# Altium schematic sheet power_supply.SchDoc: Power Supply
size A4; Date: 27.05.2014; Author: Stefan Lüthi; DrawnBy: Stefan Lüthi; Organization: BFH; Address1: Bern University of Applied Sciences; Address2: Engineering and Information Technology; Address3: Jlcoweg 1; Address4: CH-3400 Burgdorf; DocumentNumber: 1; Revision: 1.0; SheetNumber: 2; SheetTotal: 8; CurrentDate: 27.05.2014
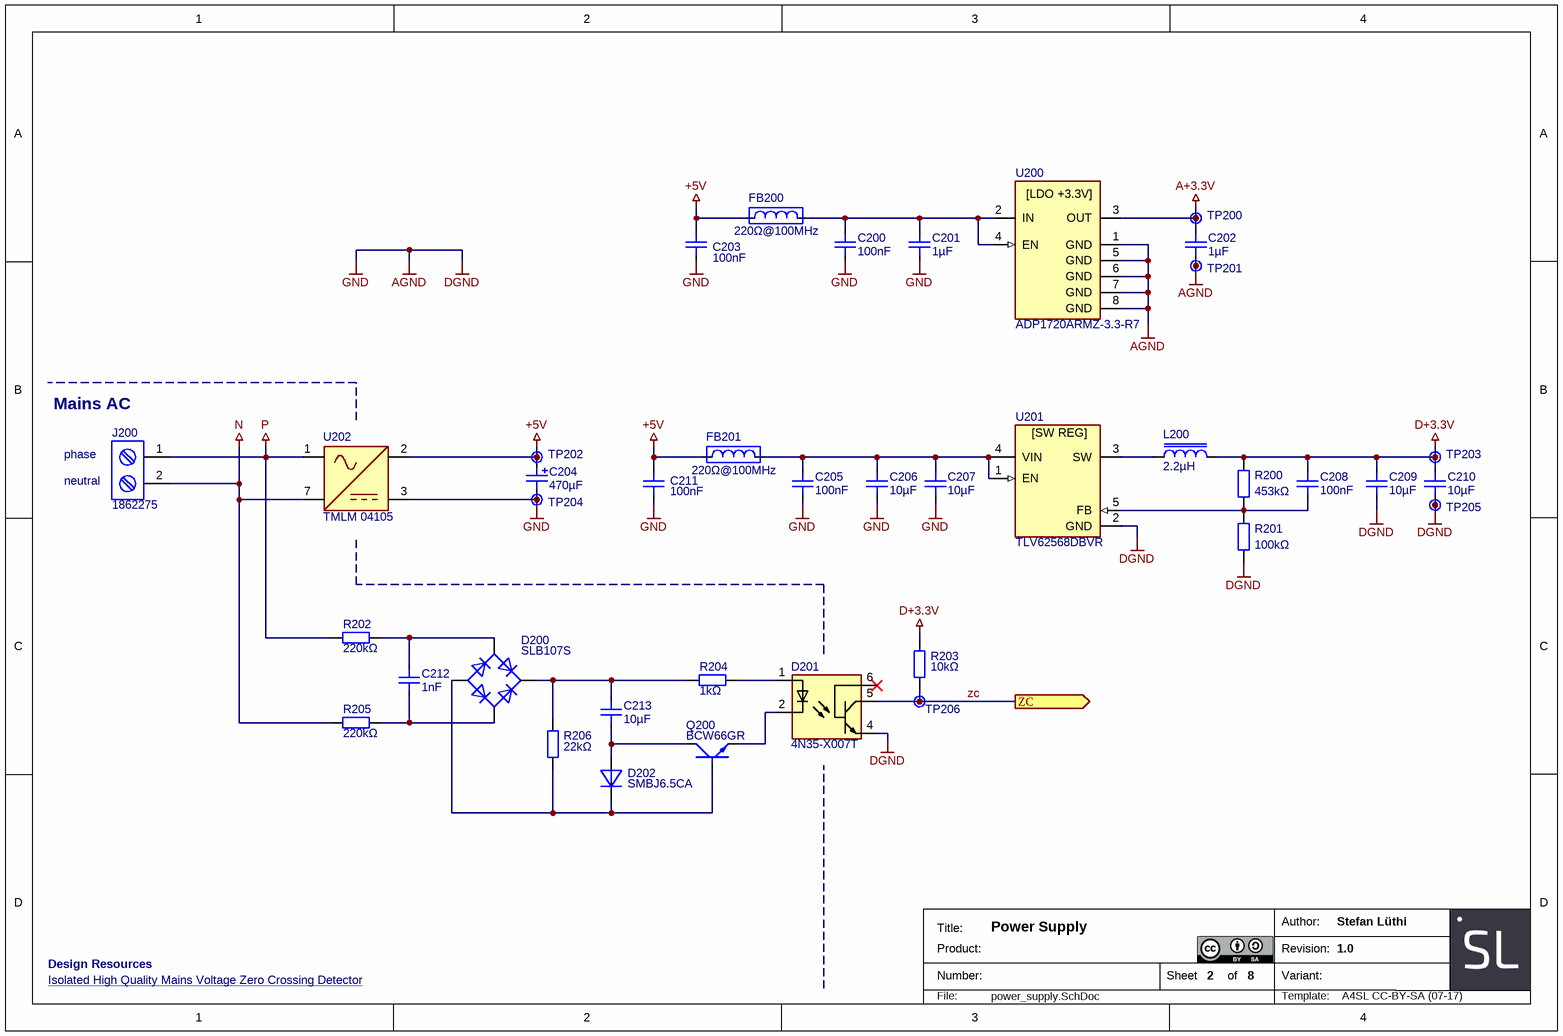
[diagram p0: power_supply.SchDoc]

## Parts
C200  100nF  [SMD0603CAP]
C201  1µF  [SMD0603CAP]
C202  1µF  [SMD0603CAP]
C203  100nF  [SMD0603CAP]
C204  470µF  [CAP-12.5-20-5]
C205  100nF  [SMD0603CAP]
C206  10µF  [SMD1206CAP]
C207  10µF  [SMD1206CAP]
C208  100nF  [SMD0603CAP]
C209  10µF  [SMD1206CAP]
C210  10µF  [SMD1206CAP]
C211  100nF  [SMD0603CAP]
C212  1nF  [SMD0603CAP]
C213  10µF  [SMD1206CAP]
D200  SLB107S  [SLDBS-4]
D201  4N35-X007T  [SMT6-LB]
D202  SMBJ6.5CA  [DO-214AA]
FB200  220Ω@100MHz  [SMD0603RES]
FB201  220Ω@100MHz  [SMD0603RES]
J200  1862275  [1862275]
L200  2.2µH  [WE4040]
Q200  BCW66GR  [SOT-23]
R200  453kΩ  [SMD0603RES]
R201  100kΩ  [SMD0603RES]
R202  220kΩ  [SMD2010RES]
R203  10kΩ  [SMD0603RES]
R204  1kΩ  [SMD0603RES]
R205  220kΩ  [SMD2010RES]
R206  22kΩ  [SMD0603RES]
TP200  Testpoint  [TP]  (value not drawn)  (no BOM)
TP201  Testpoint  [TP]  (value not drawn)  (no BOM)
TP202  Testpoint  [TP]  (value not drawn)  (no BOM)
TP203  Testpoint  [TP]  (value not drawn)  (no BOM)
TP204  Testpoint  [TP]  (value not drawn)  (no BOM)
TP205  Testpoint  [TP]  (value not drawn)  (no BOM)
TP206  Testpoint  [TP]  (value not drawn)  (no BOM)
U200  ADP1720ARMZ-3.3-R7  [MSOP8]
U201  TLV62568DBVR  [SOT-23-5]
U202  TMLM 04105  [TMLM04]

## Ports
ZC (out)

## Nets
+5V: C203.1 C204.P C211.1 FB200.1 FB201.1 TP202.1 U202.2(V+)
A+3.3V: C202.1 TP200.1 U200.3(OUT)
AGND: C200.2 C201.2 C202.2 C203.2 C204.M C205.2 C206.2 C207.2 C209.2 C210.2 C211.2 D201.4 R201.1 TP201.1 TP204.1 TP205.1 U200.1(GND) U200.5(GND) U200.6(GND) U200.7(GND) U200.8(GND) U201.2(GND) U202.3(GND)  [also labelled DGND, GND]
D+3.3V: C208.1 C209.1 C210.1 L200.2 R200.2 R203.2 TP203.1
N: J200.2 R205.2 U202.7(AC)
P: J200.1 R202.2 U202.1(AC)
zc: D201.5 R203.1 TP206.1 ; port ZC
NetC200_1: C200.1 C201.1 FB200.2 U200.2(IN) U200.4(EN)
NetC205_1: C205.1 C206.1 C207.1 FB201.2 U201.1(EN) U201.4(VIN)
NetC208_2: C208.2 R200.1 R201.2 U201.5(FB)
NetC212_1: C212.1 D200.3 R205.1
NetC212_2: C212.2 D200.2 R202.1
NetC213_1: C213.1 D200.1 R204.2 R206.2
NetC213_2: C213.2 D202.A Q200.3(C)
NetD200_4: D200.4 D202.C Q200.1(B) R206.1
NetD201_1: D201.1 R204.1
NetD201_2: D201.2 Q200.2(E)
NetL200_1: L200.1 U201.3(SW)

Not connected (* = marked no-connect by the designer): D201 6*

## Notes on the sheet
- (near J200) Mains AC
- (near J200) neutral
- (near J200) phase
- Isolated High Quality Mains Voltage Zero Crossing Detector <https://cdn.hackaday.io/files/1597066832861504/SimpleIsolatedZeroCrossDetector.pdf>
- Design Resources
- Author:
- Title:
- Number:
- Product:
- Sheet
- of
- Variant:
- Revision:
- File:
- Template:
- A4SL CC-BY-SA (07-17)
- (in symbol ADP1720ARMZ-3.3-R7) [LDO +3.3V]
- (in symbol TLV62568DBVR) [SW REG]

## Library data of the parts
C200-C203 C205-C213 = Capacitor Ceramic: Ceramic Capacitor
C204 = Capacitor Electrolytic: Elektrolytic Capacitor
D200 = Rectifier: Full Bridge Rectifier
D201 = 4N35-X: Optocoupler
D202 = Diode
FB200 FB201 = Ferrite Bead
J200 = 1862275: Screw Terminal, 2 Position, 5mm Spacing
L200 = Inductor
Q200 = Transistor NPN: Bipolar transistor NPN
R200-R206 = Resistor
U200 = ADP1720ARMZ-3.3-R7: LDO 3.3V Output
U201 = TLV62568DBVR: Step-Down Regulator
U202 = TMLM 04: AC/DC Converter (100VAC - 240VAC to 5VDC)